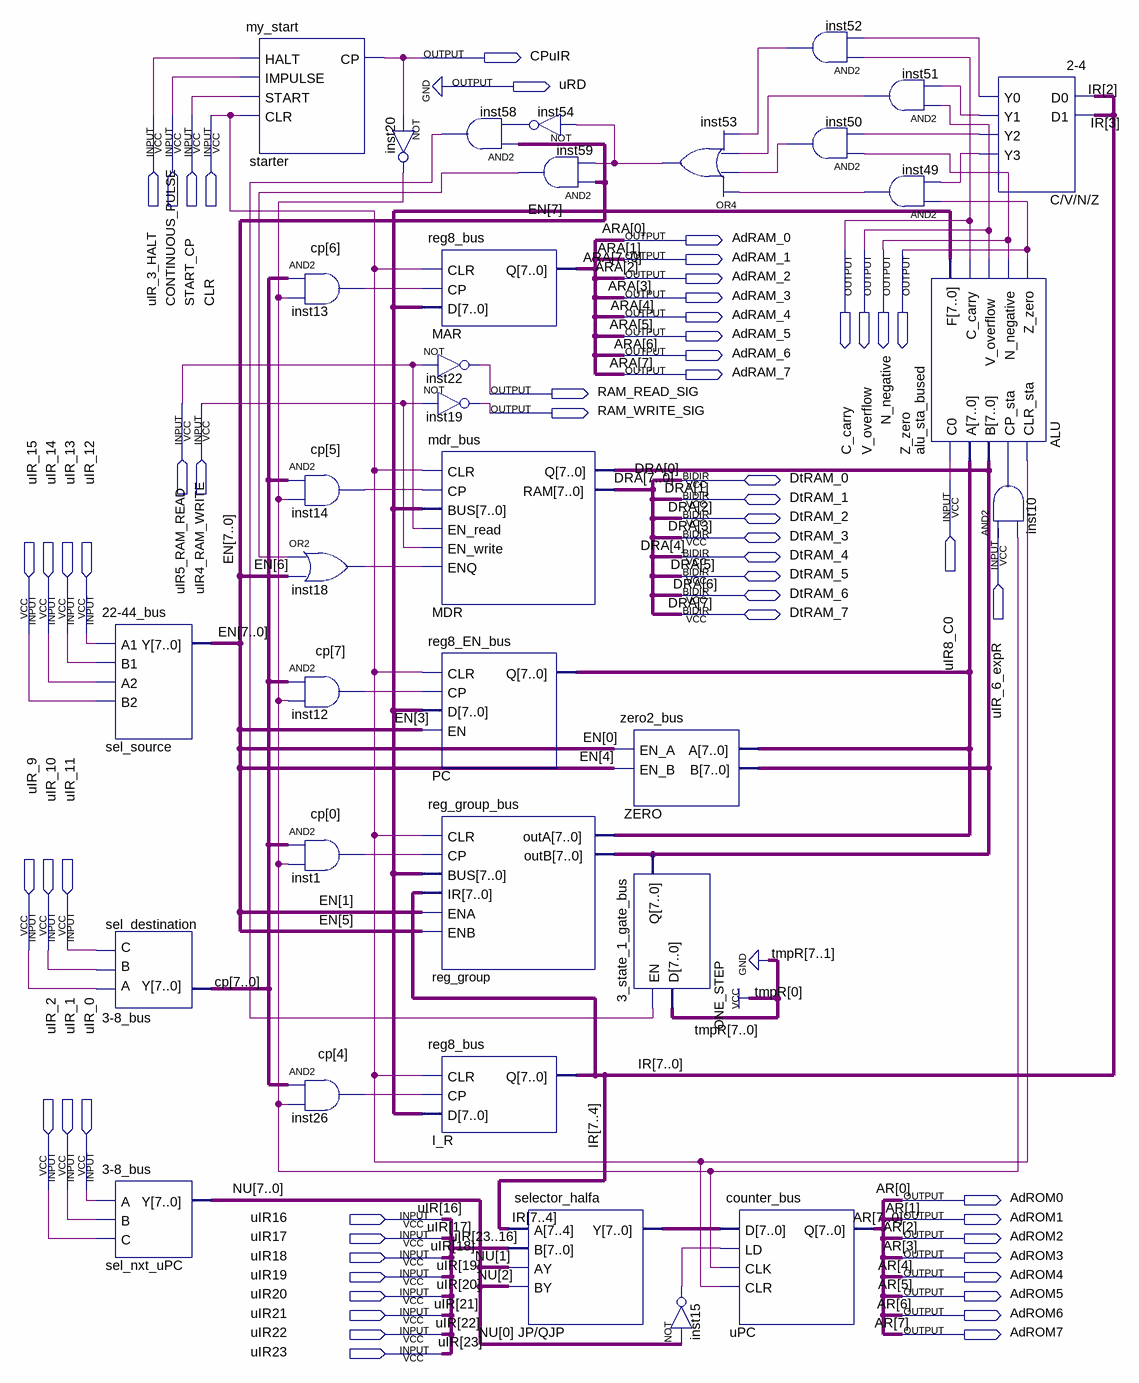
[diagram p0: schematic sheet]
// Quartus schematic final_design.bdf as structural Verilog: 34 symbols, 58 pins
module final_design (
  input  uIR_3_HALT,
  input  CONTINUOUS_PULSE,
  input  START_CP,
  input  CLR,
  input  uIR5_RAM_READ,
  input  uIR4_RAM_WRITE,
  input  uIR8_C0,
  input  uIR_6_expR,
  input  uIR_15,
  input  uIR_14,
  input  uIR_13,
  input  uIR_12,
  input  uIR_9,
  input  uIR_10,
  input  uIR_11,
  input  uIR_2,
  input  uIR_1,
  input  uIR_0,
  input  uIR16,
  input  uIR17,
  input  uIR18,
  input  uIR19,
  input  uIR20,
  input  uIR21,
  input  uIR22,
  input  uIR23,
  inout  DtRAM_0,
  inout  DtRAM_1,
  inout  DtRAM_2,
  inout  DtRAM_3,
  inout  DtRAM_4,
  inout  DtRAM_5,
  inout  DtRAM_6,
  inout  DtRAM_7,
  output CPuIR,
  output uRD,
  output AdRAM_0,
  output C_carry,
  output V_overflow,
  output N_negative,
  output Z_zero,
  output AdRAM_1,
  output AdRAM_2,
  output AdRAM_3,
  output AdRAM_4,
  output AdRAM_5,
  output AdRAM_6,
  output AdRAM_7,
  output RAM_READ_SIG,
  output RAM_WRITE_SIG,
  output AdROM0,
  output AdROM1,
  output AdROM2,
  output AdROM3,
  output AdROM4,
  output AdROM5,
  output AdROM6,
  output AdROM7
);

  wire C_V_N_Z_y0, C_V_N_Z_y1, C_V_N_Z_y2, C_V_N_Z_y3, inst1_out, inst10_out, inst12_out, inst13_out,
       inst14_out, inst15_out, inst18_out, inst20_out, inst26_out, inst49_out, inst50_out, inst51_out,
       inst52_out, inst53_out, inst54_out, inst58_out, inst59_out;
  wire [7:0] ALU_f, cp, EN, IR, JP_QJP_y, MDR_q, NU, PC_q;

  \22-44_bus  sel_source (.A1(uIR_12), .B1(uIR_13), .A2(uIR_14), .B2(uIR_15), .Y(EN));
  \3-8_bus  sel_destination (.A(uIR_9), .B(uIR_10), .C(uIR_11), .Y(cp));
  \3-8_bus  sel_nxt_uPC (.A(uIR_0), .B(uIR_1), .C(uIR_2), .Y(NU));
  my_start starter (.HALT(uIR_3_HALT), .IMPULSE(CONTINUOUS_PULSE), .START(START_CP), .CLR(CLR), .CP(CPuIR));
  and inst13 (inst13_out, cp[6], inst20_out);
  and inst14 (inst14_out, cp[5], inst20_out);
  or inst18 (inst18_out, inst59_out, EN[6]);
  and inst12 (inst12_out, cp[7], inst20_out);
  and inst1 (inst1_out, cp[0], inst20_out);
  and inst26 (inst26_out, cp[4], inst20_out);
  not inst20 (inst20_out, CPuIR);
  and inst58 (inst58_out, EN[7], inst54_out);
  reg8_bus MAR (
    .CLR(CLR), .CP(inst13_out), .D(ALU_f),
    .Q({AdRAM_7, AdRAM_6, AdRAM_5, AdRAM_4, AdRAM_3, AdRAM_2, AdRAM_1, AdRAM_0}));
  not inst22 (RAM_READ_SIG, uIR5_RAM_READ);
  not inst19 (RAM_WRITE_SIG, uIR4_RAM_WRITE);
  mdr_bus MDR (
    .CLR(CLR), .CP(inst14_out), .BUS(ALU_f), .EN_read(uIR5_RAM_READ), .EN_write(uIR4_RAM_WRITE),
    .ENQ(inst18_out), .Q(MDR_q),
    .RAM({DtRAM_7, DtRAM_6, DtRAM_5, DtRAM_4, DtRAM_3, DtRAM_2, DtRAM_1, DtRAM_0}));
  reg8_EN_bus PC (.CLR(CLR), .CP(inst12_out), .D(ALU_f), .EN(EN[3]), .Q(PC_q));
  reg_group_bus reg_group (
    .CLR(CLR), .CP(inst1_out), .BUS(ALU_f), .IR(IR), .ENA(EN[1]), .ENB(EN[5]), .outA(PC_q), .outB(MDR_q));
  reg8_bus I_R (.CLR(CLR), .CP(inst26_out), .D(ALU_f), .Q(IR));
  not inst54 (inst54_out, inst53_out);
  and inst59 (inst59_out, EN[7], inst53_out);
  selector_halfa \JP/QJP  (
    .A(IR[7:4]), .B({uIR23, uIR22, uIR21, uIR20, uIR19, uIR18, uIR17, uIR16}), .AY(NU[1]), .BY(NU[2]),
    .Y(JP_QJP_y));
  zero2_bus ZERO (.EN_A(EN[0]), .EN_B(EN[4]), .A(PC_q), .B(MDR_q));
  \3_state_1_gate_bus  ONE_STEP (.EN(inst58_out), .D(8'b00000001), .Q(MDR_q));
  or inst53 (inst53_out, inst49_out, inst50_out, inst51_out, inst52_out);
  not inst15 (inst15_out, NU[0]);
  counter_bus uPC (
    .D(JP_QJP_y), .LD(inst15_out), .CLK(inst20_out), .CLR(CLR),
    .Q({AdROM7, AdROM6, AdROM5, AdROM4, AdROM3, AdROM2, AdROM1, AdROM0}));
  and inst52 (inst52_out, C_carry, C_V_N_Z_y0);
  and inst50 (inst50_out, N_negative, C_V_N_Z_y2);
  and inst51 (inst51_out, V_overflow, C_V_N_Z_y1);
  and inst49 (inst49_out, Z_zero, C_V_N_Z_y3);
  alu_sta_bused ALU (
    .C0(uIR8_C0), .A(PC_q), .B(MDR_q), .CP_sta(inst10_out), .CLR_sta(CLR), .F(ALU_f), .C_carry(C_carry),
    .V_overflow(V_overflow), .N_negative(N_negative), .Z_zero(Z_zero));
  \2-4  \C/V/N/Z  (.D0(IR[2]), .D1(IR[3]), .Y0(C_V_N_Z_y0), .Y1(C_V_N_Z_y1), .Y2(C_V_N_Z_y2), .Y3(C_V_N_Z_y3));
  and inst10 (inst10_out, uIR_6_expR, inst20_out);

  assign uRD = 1'b0;

  // Other names for the same wires on the sheet: AR[7:0] = {AdROM7, AdROM6, AdROM5, AdROM4, AdROM3, AdROM2, AdROM1, AdROM0};
  //   ARA[7:0] = {AdRAM_7, AdRAM_6, AdRAM_5, AdRAM_4, AdRAM_3, AdRAM_2, AdRAM_1, AdRAM_0};
  //   DRA[7:0] = {DtRAM_7, DtRAM_6, DtRAM_5, DtRAM_4, DtRAM_3, DtRAM_2, DtRAM_1, DtRAM_0}
endmodule
